# Altium schematic sheet MCU_Extras.SchDoc
size Tabloid; SheetNumber: 1; SheetTotal: 3
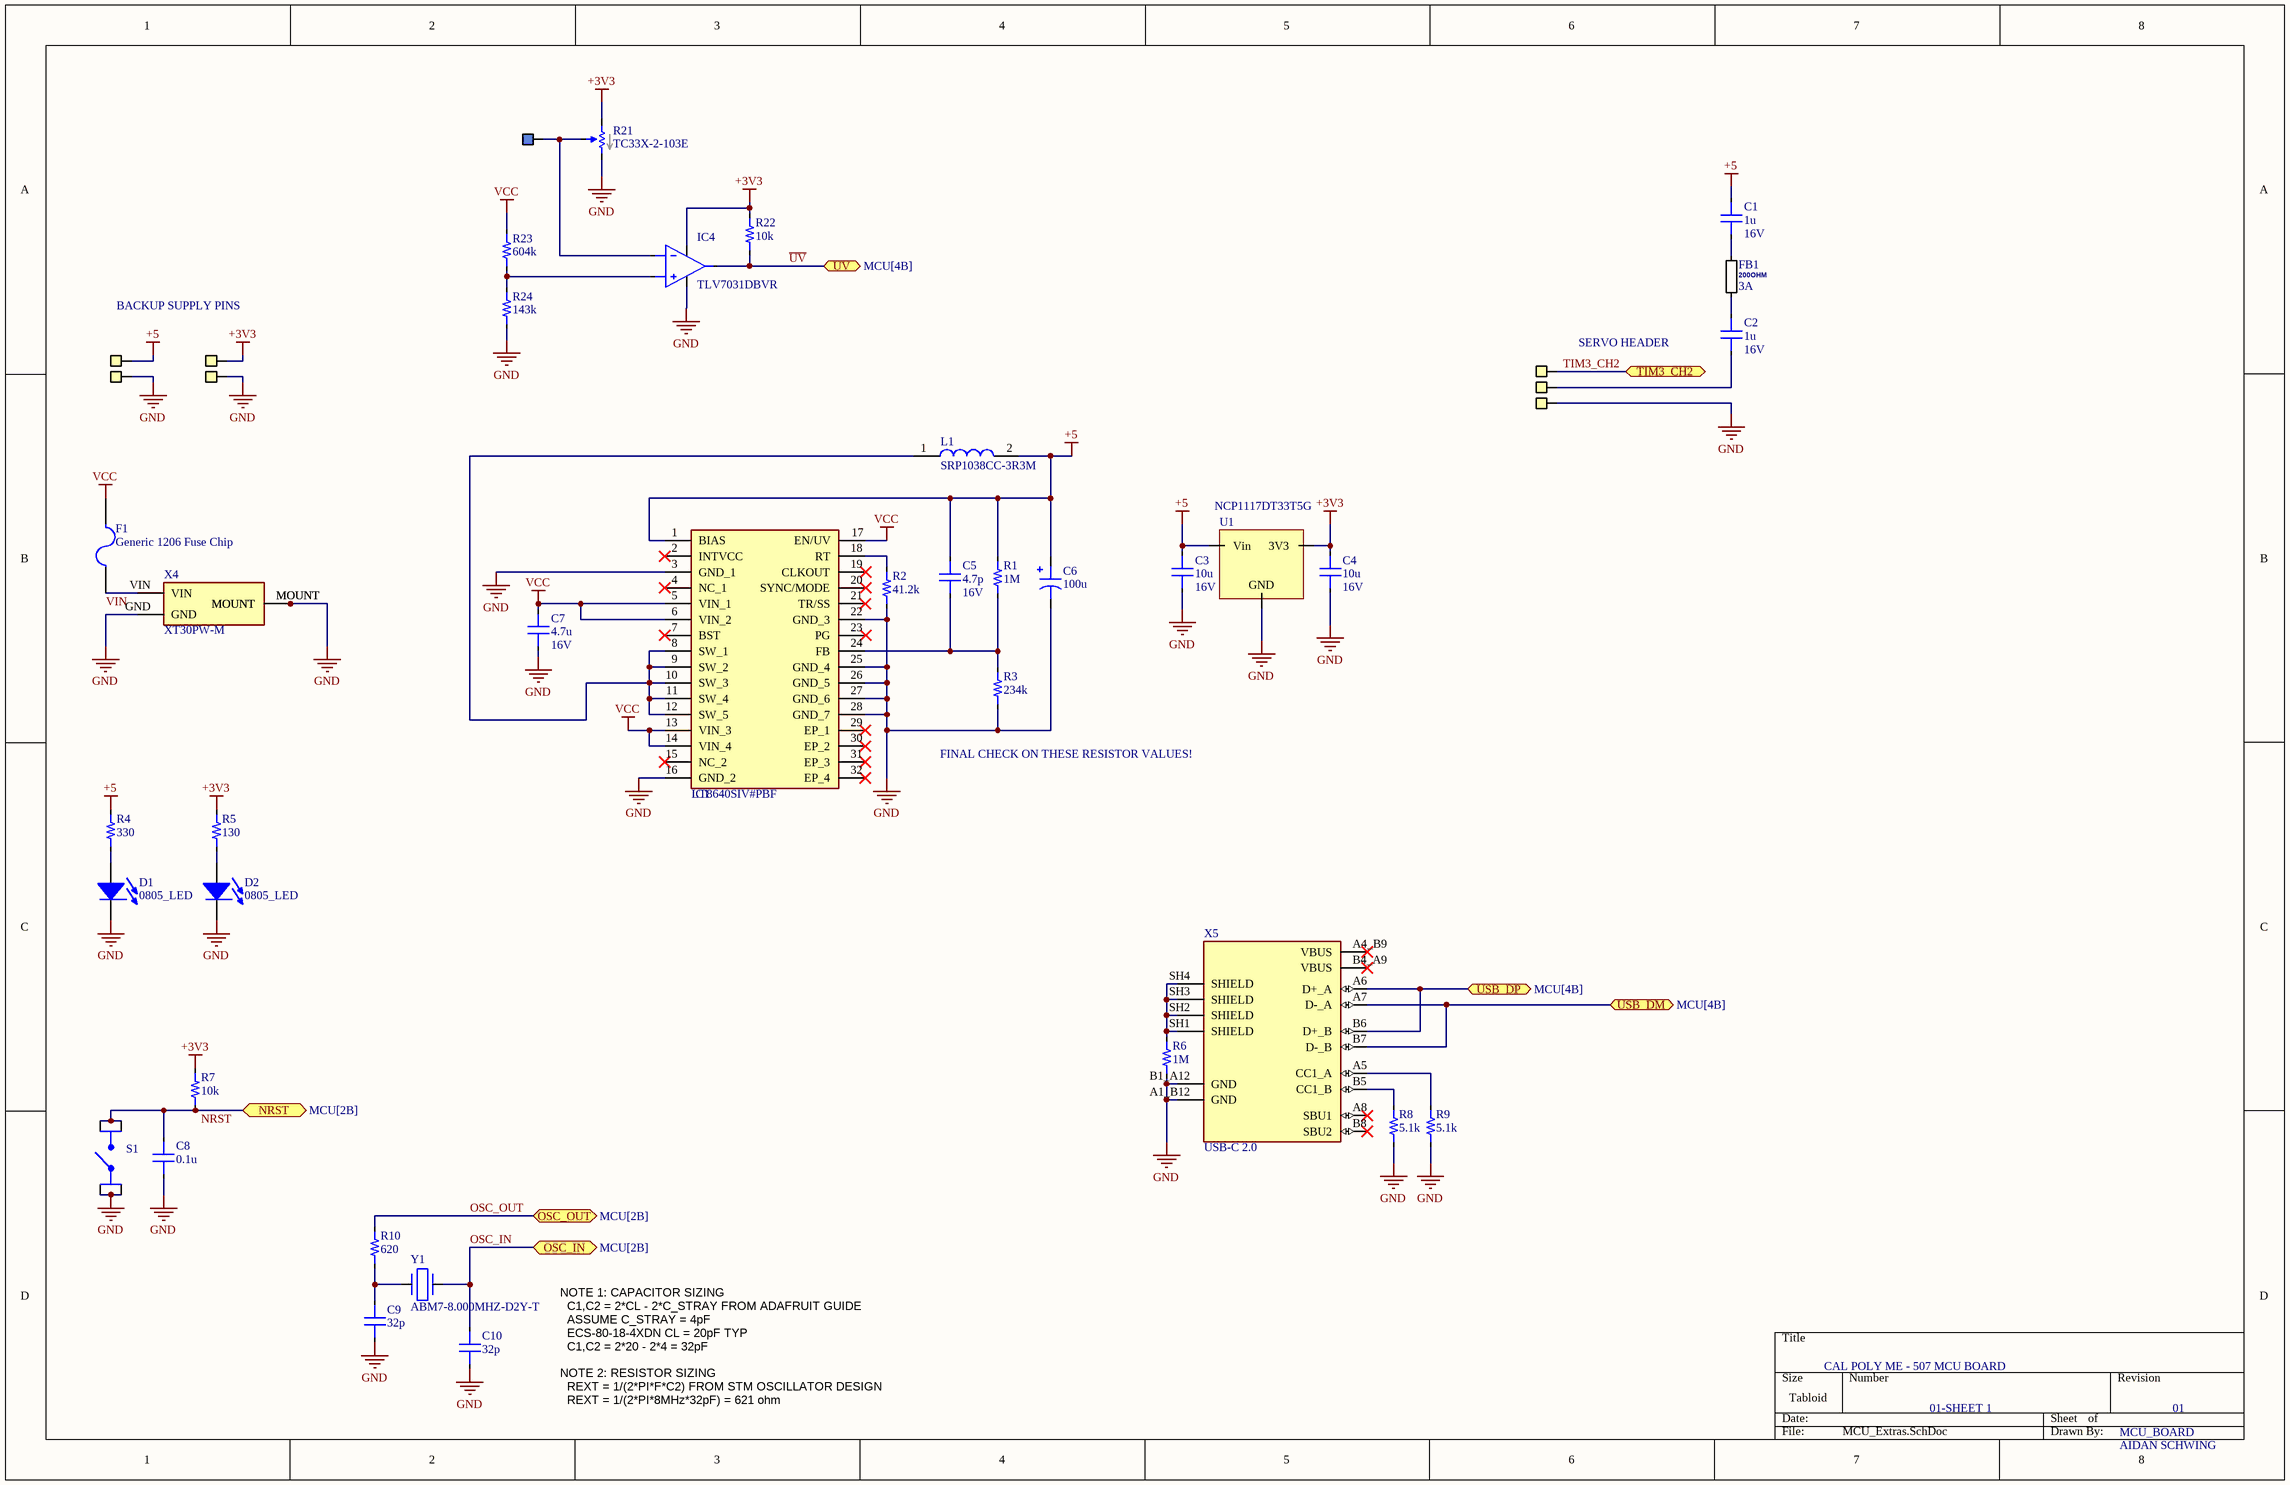
[diagram p0: MCU_Extras.SchDoc]

## Parts
C1  value 1u  Voltage: 16V  [0603_CAP]  (hidden comment: Capacitor)
C2  value 1u  Voltage: 16V  [0603_CAP]  (hidden comment: Capacitor)
C3  value 10u  Voltage: 16V  [0805_CAP]  (hidden comment: Capacitor)
C4  value 10u  Voltage: 16V  [0805_CAP]  (hidden comment: Capacitor)
C5  value 4.7p  Voltage: 16V  [0603_CAP]  (hidden comment: Capacitor)
C6  value 100u  [6.60x6.60x8.00mm_E_CAP]  (hidden comment: 865080343009)
C7  value 4.7u  Voltage: 16V  [0805_CAP]  (hidden comment: Capacitor)
C8  value 0.1u  [0805_CAP]  (hidden comment: Capacitor)
C9  value 32p  [0805_CAP]  (hidden comment: Capacitor)
C10  value 32p  [0805_CAP]  (hidden comment: Capacitor)
D1  0805_LED  [0805_LED]
D2  0805_LED  [0805_LED]
F1  Generic 1206 Fuse Chip  [1206_RES]
FB1  =Z@100MHz: 200OHM  iMax: 3A  [0805_Ferrite]  (hidden comment: *)
IC1  LT8640SIV#PBF  [LT8640SIVPBF]
IC4  TLV7031DBVR  [SOT95P280X145-5N]
L1  SRP1038CC-3R3M  [INDPM110100X400N]
R1  value 1M  [0805_RES]  (hidden comment: Resistor)
R2  value 41.2k  [0805_RES]  (hidden comment: Resistor)
R3  value 234k  [0805_RES]  (hidden comment: Resistor)
R4  value 330  [0603_RES]  (hidden comment: Resistor)
R5  value 130  [0603_RES]  (hidden comment: Resistor)
R6  value 1M  [0805_RES]  (hidden comment: Resistor)
R7  value 10k  [0603_RES]  (hidden comment: Resistor)
R8  value 5.1k  [0805_RES]  (hidden comment: Resistor)
R9  value 5.1k  [0805_RES]  (hidden comment: Resistor)
R10  value 620  [0805_RES]  (hidden comment: Resistor)
R21  TC33X-2-103E  [35WR]
R22  value 10k  [0805_RES]  (hidden comment: Resistor)
R23  value 604k  [0805_RES]  (hidden comment: Resistor)
R24  value 143k  [0805_RES]  (hidden comment: Resistor)
S1  TactileSwitch  [6mmTactileSwitch_ThroughHole]  (value not drawn)
U1  NCP1117DT33T5G  [DPAK3_TO-252-3]
X1  GenericPinHeader(0.1in)  [GenericPinHeader(.1in)]  (value not drawn)
X2  GenericPinHeader(0.1in)  [GenericPinHeader(.1in)]  (value not drawn)
X3  GenericPinHeader(0.1in)  [GenericPinHeader(.1in)]  (value not drawn)
X4  XT30PW-M  [XT30PWM]
X5  USB-C 2.0  [AMPHENOL_12402012E212A]
X11  HeaderPad  [HeaderPad]  (value not drawn)
X19  GenericPinHeader(0.1in)  [GenericPinHeader(.1in)]  (value not drawn)
X22  GenericPinHeader(0.1in)  [GenericPinHeader(.1in)]  (value not drawn)
X23  GenericPinHeader(0.1in)  [GenericPinHeader(.1in)]  (value not drawn)
X26  GenericPinHeader(0.1in)  [GenericPinHeader(.1in)]  (value not drawn)
Y1  ABM7-8.000MHZ-D2Y-T  [ABM7]

## Ports
NRST (bidir, see MCU[2B]), OSC_IN (bidir, see MCU[2B]), OSC_OUT (bidir, see MCU[2B]), TIM3_CH2 (bidir, see MCU[4B]), USB_DM (bidir, see MCU[4B]), USB_DP (bidir, see MCU[4B]), ~{UV} (bidir, see MCU[4B])

## Nets
+3V3: C4.1 IC4.5(VCC) R5.2 R7.2 R21.1 R22.2 U1.4(3V3) X22.1(Pin)
+5: C1.1 C3.1 C5.1 C6.1 IC1.1(BIAS) L1.2 R1.2 R4.2 U1.3(Vin) X19.1(Pin)
GND: C3.2 C4.2 C6.2 C7.2 C8.1 C9.1 C10.1 D1.2(K) D2.2(K) IC1.3(GND_1) IC1.16(GND_2) IC1.22(GND_3) IC1.25(GND_4) IC1.26(GND_5) IC1.27(GND_6) IC1.28(GND_7) IC4.2(VEE) R2.1 R3.1 R6.1 R8.1 R9.1 R21.3 R24.1 S1.1 S1.2 U1.1(GND) X3.1(Pin) X4.GND X4.MOUNT X5.A1_B12(GND) X5.B1_A12(GND) X23.1(Pin) X26.1(Pin)
VCC: C7.1 F1.2 IC1.5(VIN_1) IC1.6(VIN_2) IC1.13(VIN_3) IC1.14(VIN_4) IC1.17(EN/UV) R23.2
NRST: C8.2 R7.1 S1.3 S1.4 ; port NRST
OSC_IN: C10.2 Y1.2 ; port OSC_IN
OSC_OUT: R10.2 ; port OSC_OUT
TIM3_CH2: X1.1(Pin) ; port TIM3_CH2
~{UV}: IC4.1(OUT) R22.1 ; port ~{UV}
USB_DM: X5.A7(D-_A) X5.B7(D-_B) ; port USB_DM
USB_DP: X5.A6(D+_A) X5.B6(D+_B) ; port USB_DP
VIN: F1.1 X4.VIN
NetC1_2: C1.2 FB1.2
NetC2_1: C2.1 FB1.1
NetC2_2: C2.2 X2.1(Pin)
NetC5_2: C5.2 IC1.24(FB) R1.1 R3.2
NetC9_2: C9.2 R10.1 Y1.1
NetD1_1: D1.1(A) R4.1
NetD2_1: D2.1(A) R5.1
NetIC1_8: IC1.8(SW_1) IC1.9(SW_2) IC1.10(SW_3) IC1.11(SW_4) IC1.12(SW_5) L1.1
NetIC1_18: IC1.18(RT) R2.2
NetIC4_3: IC4.3(IN+) R23.1 R24.2
NetIC4_4: IC4.4(IN-) R21.2 X11.1(Pin)
NetR6_2: R6.2 X5.SH1(SHIELD) X5.SH2(SHIELD) X5.SH3(SHIELD) X5.SH4(SHIELD)
NetR8_2: R8.2 X5.B5(CC1_B)
NetR9_2: R9.2 X5.A5(CC1_A)

Not connected (* = marked no-connect by the designer): IC1 2(INTVCC)* 4(NC_1)* 7(BST)* 15(NC_2)* 19(CLKOUT)* 20(SYNC/MODE)* 21(TR/SS)* 23(PG)* 29(EP_1)* 30(EP_2)* 31(EP_3)* 32(EP_4)*; X5 A4_B9(VBUS)* A8(SBU1)* B4_A9(VBUS)* B8(SBU2)*

## Notes on the sheet
- BACKUP SUPPLY PINS
- SERVO HEADER
- (near R3) FINAL CHECK ON THESE RESISTOR VALUES!
- CAL POLY ME - 507 MCU BOARD
- NOTE 1: CAPACITOR SIZING
  C1,C2 = 2*CL - 2*C_STRAY FROM ADAFRUIT GUIDE
  ASSUME C_STRAY = 4pF
  ECS-80-18-4XDN CL = 20pF TYP
  C1,C2 = 2*20 - 2*4 = 32pF
  NOTE 2: RESISTOR SIZING
  REXT = 1/(2*PI*F*C2) FROM STM OSCILLATOR DESIGN
  REXT = 1/(2*PI*8MHz*32pF) = 621 ohm
- 01-SHEET 1
- MCU_BOARD
- 01
- AIDAN SCHWING

## Library data of the parts
C6 = 865080343009: CAP ALUM 100UF 20% 16V SMD; Percent Tolerance: 20; Dielectric: *; ESR: *; ComponentLink1Description: Digikey; ComponentLink1URL: https://www.digikey.com/en/products/detail/w%C3%BCrth-elektronik/865080343009/5728014
D1 D2 = 0805_LED: Generic 0805 LED
FB1 = ChipFerrite: Link: *; MfrPartNo: *; Name: *; Resistance: *; Package: *; Inductance: *
IC1 = LT8640SIV#PBF: Integrated Circuit; Manufacturer_Name: Analog Devices; Datasheet Link: https://www.analog.com/LT8640S/datasheet; Height: 1.03mm; Manufacturer_Part_Number: LT8640SIV#PBF; Mouser Part Number: 584-LT8640SIVPBF; Mouser Price/Stock: https://www.mouser.co.uk/ProductDetail/Analog-Devices/LT8640SIVPBF?qs=5aG0NVq1C4wLdtPauIE3hA%3D%3D; Arrow Part Number: LT8640SIV#PBF; Arrow Price/Stock: https://www.arrow.com/en/products/lt8640sivpbf/analog-devices
IC4 = TLV7031DBVR: Analog Comparators Nanopower, small size comparator with push-pull output 5-SOT-23 -40 to 125C range; Manufacturer_Name: Texas Instruments; Datasheet Link: http://www.ti.com/lit/gpn/TLV7031; Height: 1.45mm; Manufacturer_Part_Number: TLV7031DBVR; Mouser Part Number: 595-TLV7031DBVR; Mouser Price/Stock: https://www.mouser.co.uk/ProductDetail/Texas-Instruments/TLV7031DBVR?qs=EBDBlbfErPzxbC0zg598sw%3D%3D; Arrow Part Number: TLV7031DBVR; Arrow Price/Stock: https://www.arrow.com/en/products/tlv7031dbvr/texas-instruments?region=nac
L1 = SRP1038CC-3R3M: Inductor, 3.3uH; Manufacturer_Name: Bourns; Manufacturer_Part_Number: SRP1038CC-4R7M; Datasheet Link: https://www.digikey.com/en/products/detail/bourns-inc/SRP1038CC-3R3M/21263957?s=N4IgTCBcDaIMoCUAKBGADAZgBwGEcFoMEMBZEAXQF8g; Height: 4mm
R21 = TC33X-2-103E: 0.1W, 1/10W J Lead Surface Mount Trimmer Potentiometer Cermet Turn Top Adjustment; Value: 10k; ComponentLink1Description: Digikey; ComponentLink1URL: https://www.digikey.com/en/products/detail/bourns-inc/TC33X-2-103E/612911; Power: 1/10W
S1 = TactileSwitch: Generic 6mm Through Hole Tactile Switch; Current: 0.05A; MaxVoltage: 12V; Pole: 1; Name: TactileSwitch; Mounting: TH; ComponentLink1Description: Digikey; ComponentLink1URL: https://www.digikey.com/en/products/detail/c-k/PTS645SH95-2-LFS/1146763
U1 = NCP1117DT33T5G: IC REG LINEAR 3.3V 1A DPAK
X1-X3 X19 X22 X23 X26 = GenericPinHeader(0.1in): Generic .1in(2.54mm) pitch pin header
X4 = XT30PW-M: Socket; DC supply; XT30; male; PIN: 2; on PCBs; THT; yellow; 15A; 500V; Manufacturer_Name: Amass; Datasheet Link: https://www.tme.eu/sl/Document/ce4077e36b79046da520ca73227e15de/XT30PW%20SPEC.pdf; Height: 5mm; Manufacturer_Part_Number: XT30PW-M
X5 = 12402012E212A: CONN RCP USB2.0 TYP C 24P SMD RA; MF: {'manufacturer': u'Amphenol'}; Package: None; Price: None; Value: *; MP: 12402012E212A; Availability: Unavailable
X11 = HeaderPad: Pad for pin header
Y1 = ABM7-8.000MHZ-D2Y-T: Crystal or Oscillator; Manufacturer_Name: ABRACON; Datasheet Link: https://abracon.com/Resonators/abm7.pdf; Height: 1.4mm; Manufacturer_Part_Number: ABM7-8.000MHZ-D2Y-T; Mouser Part Number: 815-ABM7-8-D2Y-T; Mouser Price/Stock: https://www.mouser.co.uk/ProductDetail/ABRACON/ABM7-8.000MHZ-D2Y-T?qs=LoTOQoUkC8SFsmY8snleBA%3D%3D; Arrow Part Number: ABM7-8.000MHZ-D2Y-T; Arrow Price/Stock: https://www.arrow.com/en/products/abm7-8.000mhz-d2y-t/abracon?region=europe
C1-C5 C7-C10 = Capacitor: Dielectric: *; Percent Tolerance: *; ESR: *
R1-R10 R22-R24 = Resistor: Tolerance: *